# EAGLE design countdown_timer (EAGLE 7.6.0)
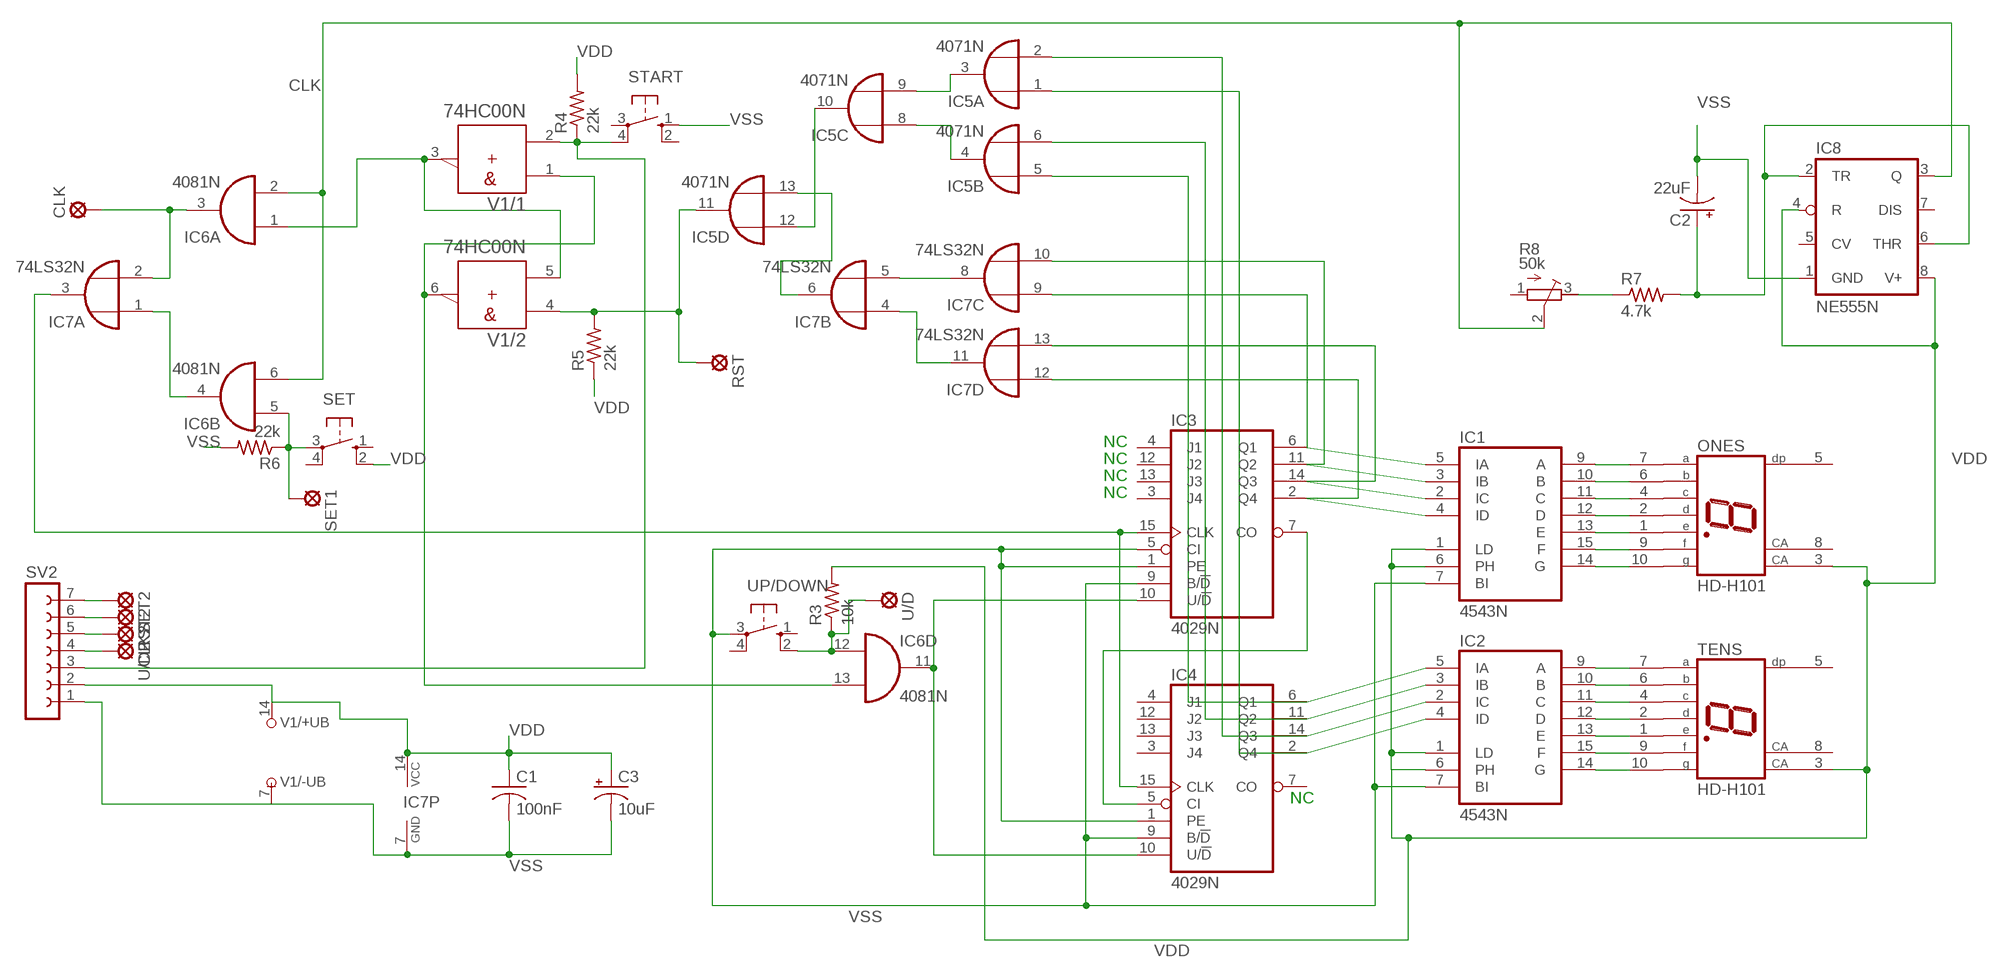
[diagram p0: schematic, sheet 1]

## Parts
C1  100nF  C-US025-024X044  [C025-024X044]
C2  22uF  CPOL-USE3.5-8  [E3,5-8]
C3  10uF  CPOL-USE3.5-8  [E3,5-8]
CLK  LSP10  [LSP10]
CLK2  LSP10  [LSP10]
IC1  4543N  [DIL16]
IC2  4543N  [DIL16]
IC3  4029N  [DIL16]
IC4  4029N  [DIL16]
IC5  4071N  [DIL14]
IC6  4081N  [DIL14]
IC7  74LS32N  [DIL14]
IC8  NE555N  [DIL08]
ONES  HD-H101  [HDSP-M]
R3  10k  R-US_0204/5  [0204/5]
R4  22k  R-US_0204/5  [0204/5]
R5  22k  R-US_0204/5  [0204/5]
R6  22k  R-US_0204/5  [0204/5]
R7  4.7k  R-US_0204/5  [0204/5]
R8  50k  R-TRIMM3339P  [RTRIM3339P]
RST  LSP10  [LSP10]
RST2  LSP10  [LSP10]
SET  10-XX  [B3F-10XX]
SET1  LSP10  [LSP10]
SET2  LSP10  [LSP10]
START  10-XX  [B3F-10XX]
SV2  FE07-1  [FE07]
TENS  HD-H101  [HDSP-M]
U/D  LSP10  [LSP10]
U/D2  LSP10  [LSP10]
UP/DOWN  10-XX  [B3F-10XX]
V1  74HC00N  [DIL14]

## Nets
CLK: IC6.2(A:I1) IC6.6(B:I1) IC8.3(Q) R8.2(S)
N$1: IC2.9(A) TENS.7(A)
N$2: IC2.10(B) TENS.6(B)
N$3: IC2.11(C) TENS.4(C)
N$4: IC2.12(D) TENS.2(D)
N$5: IC2.13(E) TENS.1(E)
N$6: IC2.15(F) TENS.9(F)
N$7: IC2.14(G) TENS.10(G)
N$8: IC1.9(A) ONES.7(A)
N$9: IC1.10(B) ONES.6(B)
N$10: IC1.11(C) ONES.4(C)
N$11: IC1.12(D) ONES.2(D)
N$12: IC1.13(E) ONES.1(E)
N$13: IC1.15(F) ONES.9(F)
N$14: IC1.14(G) ONES.10(G)
N$15: IC7.4(B:I0) IC7.11(D:O)
N$16: IC7.5(B:I1) IC7.8(C:O)
N$17: IC5.4(B:O) IC5.8(C:I0)
N$18: IC1.2(IC) IC3.14(Q3) IC7.13(D:I1)
N$19: IC2.5(IA) IC4.6(Q1) IC5.5(B:I0)
N$20: IC2.3(IB) IC4.11(Q2) IC5.6(B:I1)
N$21: IC2.2(IC) IC4.14(Q3) IC5.2(A:I1)
N$22: IC2.4(ID) IC4.2(Q4) IC5.1(A:I0)
N$23: IC3.7(CO) IC4.5(CI)
N$26: IC3.10(U/!D) IC4.10(U/!D) IC6.11(D:O)
N$27: IC6.12(D:I0) R3.1 U/D.MP UP/DOWN.2(S1)
N$28: IC5.11(D:O) R5.2 RST.MP V1.4(/2:A)
N$29: IC5.3(A:O) IC5.9(C:I1)
N$30: IC5.10(C:O) IC5.12(D:I0)
N$31: IC5.13(D:I1) IC7.6(B:O)
N$32: RST2.MP SV2.6
N$33: CLK2.MP SV2.5
N$34: SV2.4 U/D2.MP
N$35: IC6.1(A:I0) V1.3(/1:Y) V1.5(/2:B)
N$36: IC6.13(D:I1) V1.1(/1:A) V1.6(/2:Y)
N$37: R4.1 START.4(P1) SV2.3 V1.2(/1:B)
N$38: SET2.MP SV2.7
N$39: CLK.MP IC6.3(A:O) IC7.2(A:I1)
N$40: IC6.4(B:O) IC7.1(A:I0)
N$41: IC6.5(B:I0) R6.1 SET1.MP SET.3(P)
N$43: IC3.15(CLK) IC4.15(CLK) IC7.3(A:O)
N$44: R7.1 R8.3(E)
N$45: C2.+ IC8.2(TR) IC8.6(THR) R7.2
N$46: IC1.4(ID) IC3.2(Q4) IC7.12(D:I0)
N$47: IC1.3(IB) IC3.11(Q2) IC7.10(C:I1)
N$48: IC1.5(IA) IC3.6(Q1) IC7.9(C:I0)
VDD: C1.1 C3.+ IC1.1(LD) IC1.6(PH) IC2.1(LD) IC2.6(PH) IC7.14(P:VCC) IC8.4(R) IC8.8(V+) ONES.3(CA) R3.2 R4.2 R5.1 SET.2(S1) SV2.2 TENS.3(CA) V1.14(/+UB:+UB)
VSS: C1.2 C2.- C3.- IC1.7(BI) IC2.7(BI) IC3.1(PE) IC3.5(CI) IC3.9(B/!D) IC4.1(PE) IC4.9(B/!D) IC7.7(P:GND) IC8.1(GND) R6.2 START.1(S) SV2.1 UP/DOWN.3(P) V1.7(/-UB:-UB)
Unconnected: IC3.3(J4) IC3.4(J1) IC3.12(J2) IC3.13(J3) IC4.3(J4) IC4.4(J1) IC4.7(CO) IC4.12(J2) IC4.13(J3) IC6.8(C:I0) IC6.9(C:I1) IC6.10(C:O) IC8.5(CV) IC8.7(DIS) ONES.5(DP) ONES.8(CA) R8.1(A) SET.1(S) SET.4(P1) START.2(S1) START.3(P) TENS.5(DP) TENS.8(CA) UP/DOWN.1(S) UP/DOWN.4(P1) V1.8(/3:Y) V1.9(/3:A) V1.10(/3:B) V1.11(/4:Y) V1.12(/4:A) V1.13(/4:B)

## Notes on the sheet
- NC
- NC
- NC
- NC
- NC

## Power pins joined to a net without a drawn wire
VDD: IC1.16(VDD) IC2.16(VDD) IC3.16(VDD) IC4.16(VDD) IC5.14(P:VDD) IC6.14(P:VDD)
VSS: IC1.8(VSS) IC2.8(VSS) IC3.8(VSS) IC4.8(VSS) IC5.7(P:VSS) IC6.7(P:VSS)

## Library data of the parts
C1 = rcl:C-US: CAPACITOR, American symbol
C2 C3 = rcl:CPOL-US: POLARIZED CAPACITOR, American symbol
CLK CLK2 RST RST2 SET1 SET2 U/D U/D2 = solpad:LSP10: SOLDER PAD drill 1.0 mm, distributor Buerklin, 12H555
IC1 IC2 = 45xx:4543: BCD to 7-segment LCD DECODER
IC3 IC4 = 40xx:4029: Binary/decimal up/down COUNTER
IC5 = 40xx:4071: Quad 2-input OR
IC6 = 40xx:4081: Quad 2-input AND
IC7 = 74xx-eu:74*32: Quad 2-input OR gate
IC8 = linear:*555: TIMER
ONES TENS = display-hp:HD-H101: LED DISPLAY 1-character 7 segment, decimal point right; OC_FARNELL: unknown; OC_NEWARK: unknown
R3-R7 = rcl:R-US_: RESISTOR, American symbol
R8 = rcl:R-TRIMM: Trimm resistor
SET START UP/DOWN = switch-omron:10-XX: OMRON SWITCH; MPN: B3F-1000; OC_FARNELL: 176432; OC_NEWARK: 36M3542
SV2 = con-lsta:FE07-1: FEMALE HEADER; OC_FARNELL: unknown; OC_NEWARK: unknown
V1 = 74ttl-din:74*00: Quad 2-input NAND gate

## Board
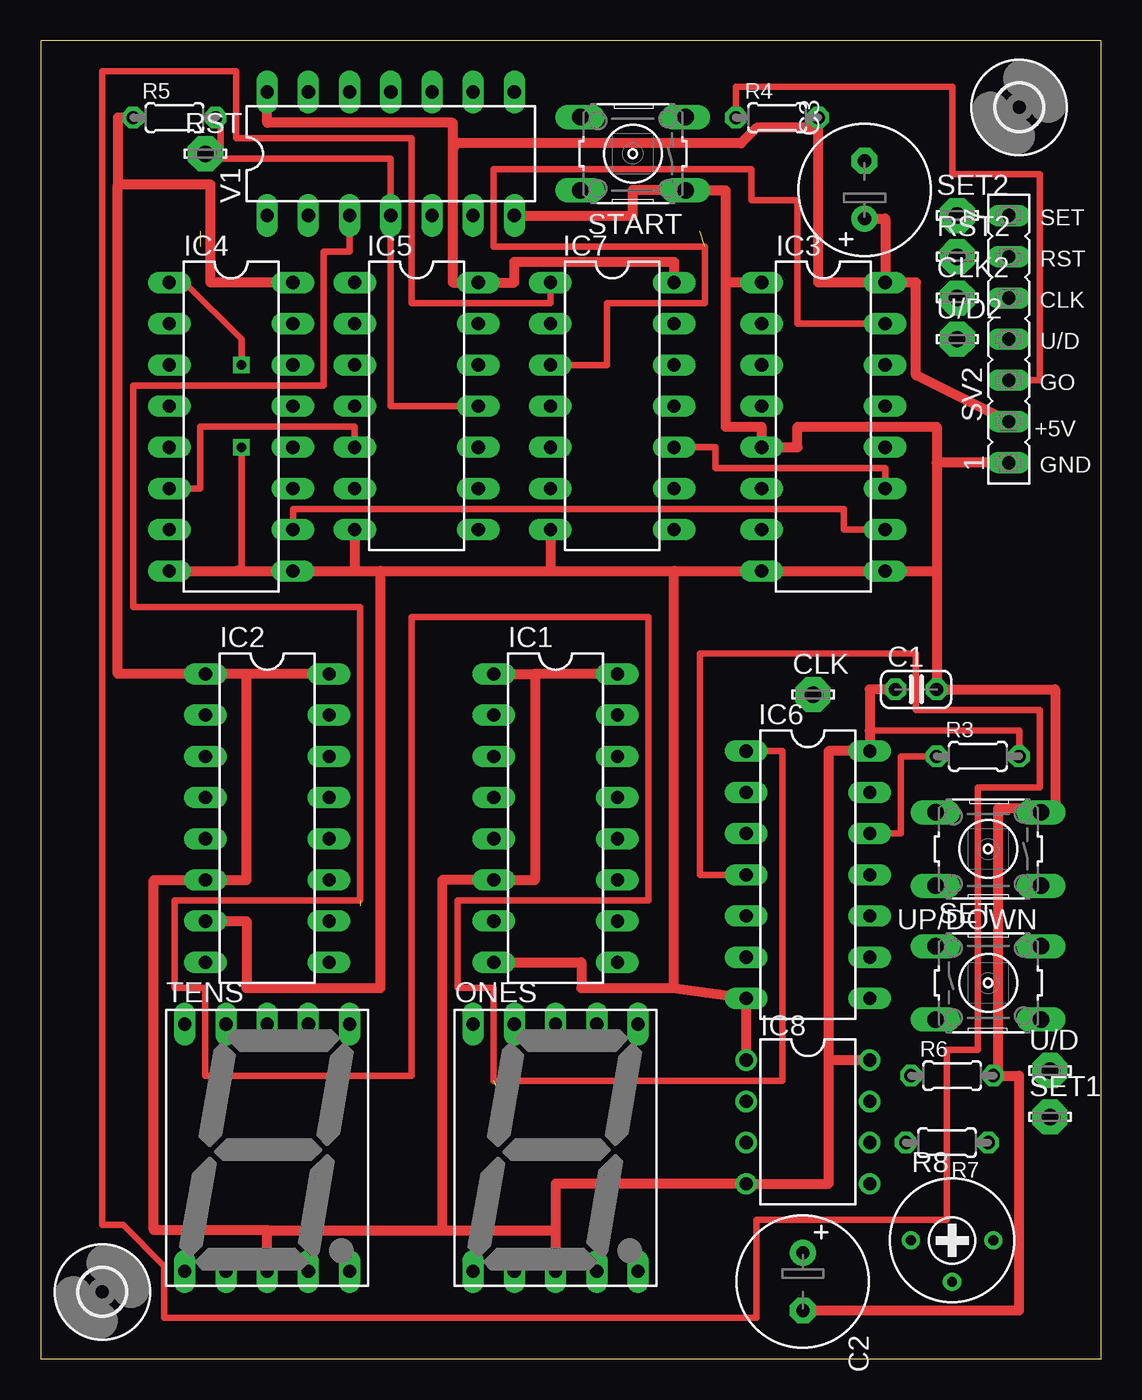
[diagram p1: board, top side]
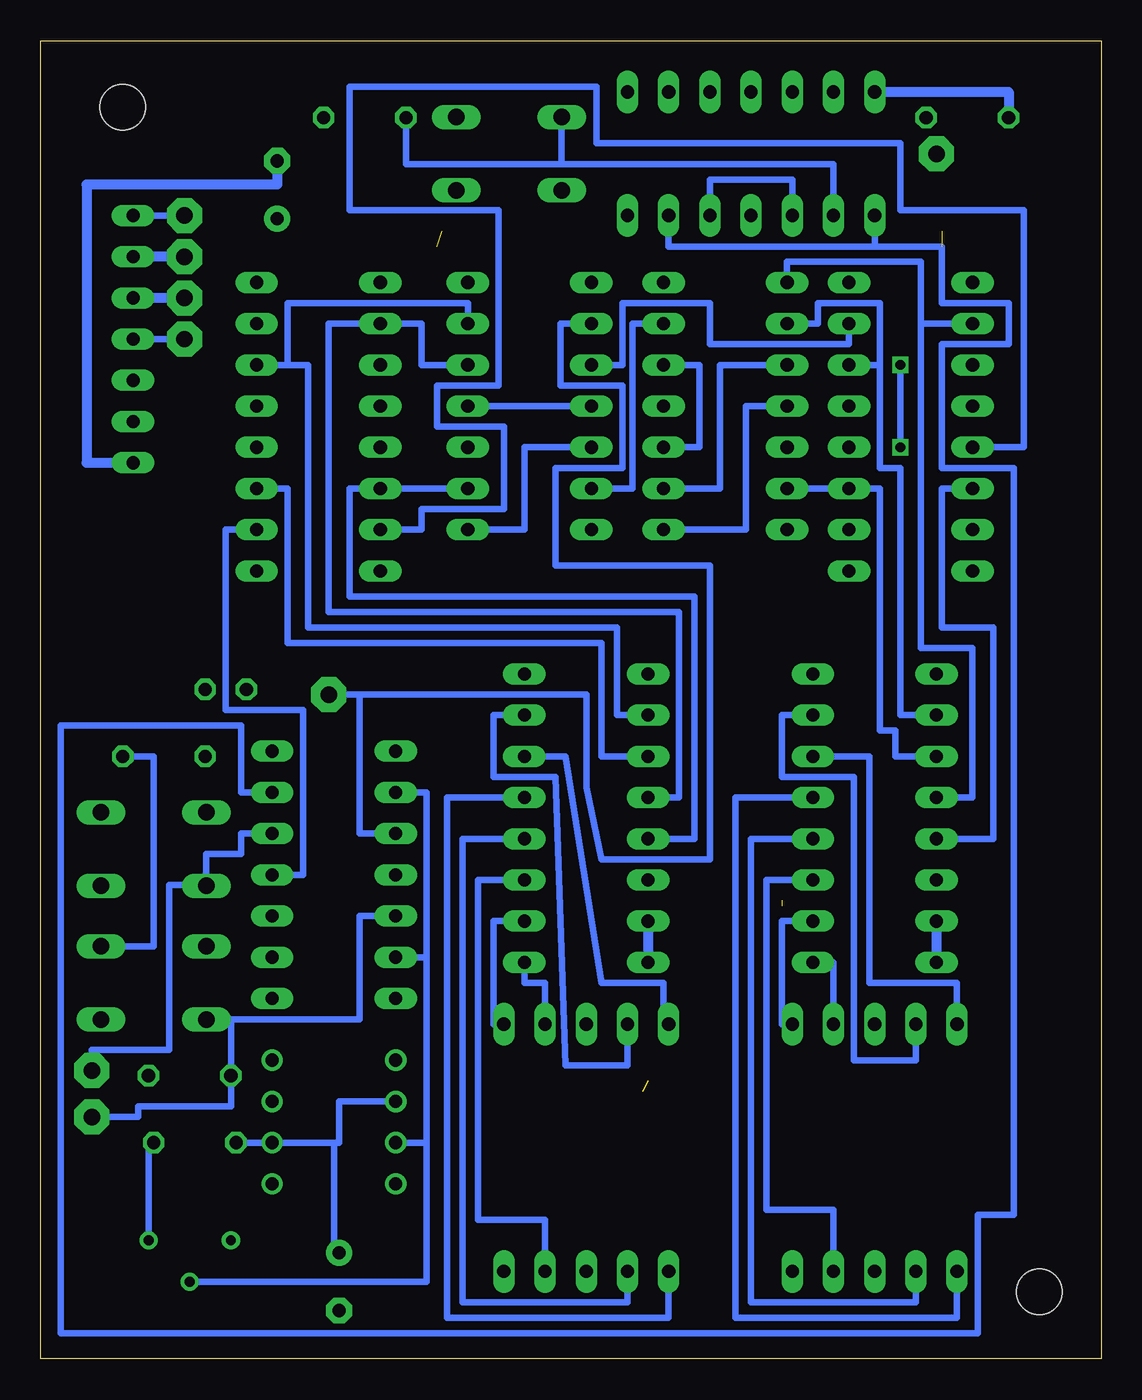
[diagram p2: board, bottom side, seen from below]

Size 65.39 x 81.27 mm. Coordinates in mm from the lower left corner, seen from the top.
Outline: 0,0 65.39,0 65.39,81.27 0,81.27 0,0
Copper layers (1*16): Top 0.035mm / dielectric 1.5mm / Bottom 0.035mm
Design rules "default": minimum track width 10mil, minimum drill 24mil, track to track 8mil, track to pad 8mil, pad to pad 8mil, via to via 8mil, smd to smd 8mil, copper to edge 40mil, drill to drill 8mil, minimum pad ring 10mil, minimum via ring 8mil, stop-mask expansion 4mil, vias tented up to drill 0mil, thermal gap 10mil

### Footprints (pad centres in the part's own frame; a part is rotated, then mirrored left to right if it is on the bottom)
C025-024X044 = drill 0.813 octagon: 1 -1.27,0; 2 1.27,0
E3,5-8 = drill 0.813 pad 1.6: + -1.778,0 | drill 0.813 pad 1.6 octagon: - 1.778,0
LSP10 = drill 1.016 pad 2.159 octagon: MP 0,0
DIL16 = drill 0.813 long: 1 -8.89,-3.81; 2 -6.35,-3.81; 3 -3.81,-3.81; 4 -1.27,-3.81; 5 1.27,-3.81; 6 3.81,-3.81; 7 6.35,-3.81; 8 8.89,-3.81; 9 8.89,3.81; 10 6.35,3.81; 11 3.81,3.81; 12 1.27,3.81; 13 -1.27,3.81; 14 -3.81,3.81; 15 -6.35,3.81; 16 -8.89,3.81
DIL14 = drill 0.813 long: 1 -7.62,-3.81; 2 -5.08,-3.81; 3 -2.54,-3.81; 4 0,-3.81; 5 2.54,-3.81; 6 5.08,-3.81; 7 7.62,-3.81; 8 7.62,3.81; 9 5.08,3.81; 10 2.54,3.81; 11 0,3.81; 12 -2.54,3.81; 13 -5.08,3.81; 14 -7.62,3.81
DIL08 = drill 0.813 pad 1.27: 1 -3.81,-3.81; 2 -1.27,-3.81; 3 1.27,-3.81; 4 3.81,-3.81; 5 3.81,3.81; 6 1.27,3.81; 7 -1.27,3.81; 8 -3.81,3.81
HDSP-M = drill 0.813 long: 1 -5.08,-7.62; 2 -2.54,-7.62; 3 0,-7.62; 4 2.54,-7.62; 5 5.08,-7.62; 6 5.08,7.62; 7 2.54,7.62; 8 0,7.62; 9 -2.54,7.62; 10 -5.08,7.62
0204/5 = drill 0.813 octagon: 1 -2.54,0; 2 2.54,0
RTRIM3339P = drill 0.61: 1 -2.54,0; 2 0,-2.54; 3 2.54,0
B3F-10XX = drill 1.016 long: 1 -3.251,2.261; 2 3.251,2.261; 3 -3.251,-2.261; 4 3.251,-2.261
FE07 = drill 0.813 long: 1 -7.62,0; 2 -5.08,0; 3 -2.54,0; 4 0,0; 5 2.54,0; 6 5.08,0; 7 7.62,0
2,8 = hole 2.8: 0,0

### Placement (x,y rotation side)
C1  53.98,41.27 0 top
C2  46.99,4.76 270 top
C3  50.8,72.07 90 top
CLK  47.62,40.96 0 top
CLK2  56.52,65.41 0 top
IC1  31.75,33.34 270 top
IC2  13.97,33.34 270 top
IC3  48.26,57.47 270 top
IC4  11.75,57.47 270 top
IC5  23.18,58.74 270 top
IC6  47.31,29.84 270 top
IC7  35.24,58.74 270 top
IC8  47.31,14.61 270 top
ONES  31.75,13.02 0 top
R3  57.78,37.15 0 top
R4  45.4,76.52 0 top
R5  8.26,76.52 0 top
R6  56.2,17.46 0 top
R7  55.88,13.34 180 top
R8  56.2,7.3 0 top
RST  10.16,74.3 0 top
RST2  56.52,67.94 0 top
SET  58.42,23.18 0 top
SET1  62.23,14.92 0 top
SET2  56.52,70.48 0 top
START  36.51,74.3 180 top
SV2  59.69,62.87 90 top
TENS  13.97,13.02 0 top
U$2  [2,8]  60.33,77.15 0 top
U$3  [2,8]  3.81,4.13 0 top
U/D  62.23,17.78 0 top
U/D2  56.52,62.87 0 top
UP/DOWN  58.42,31.43 180 top
V1  21.59,74.3 0 top

### Tracks (layer width: path | path; a pad name or v marks a point on that pad's centre or on a via)
CLK
  Bottom 0.406: IC8.3 41.59,13.34 | 41.59,13.34 41.59,24.77 | 41.59,24.77 IC6.6 | R8.2 41.59,4.76 41.59,13.34 | IC6.2 41.59,34.92 41.59,24.77
N$1
  Bottom 0.406: IC2.9 16.51,24.45 TENS.7
N$2
  Bottom 0.406: IC2.10 19.68,26.99 19.68,20.64 TENS.6
N$3
  Bottom 0.406: IC2.11 20.64,29.53 20.64,9.21 16.51,9.21 TENS.4
N$4
  Bottom 0.406: IC2.12 21.59,32.07 21.59,3.49 11.43,3.49 TENS.2
N$5
  Bottom 0.406: TENS.1 8.89,2.54 22.54,2.54 22.54,34.61 IC2.13
N$6
  Bottom 0.406: IC2.15 19.68,39.69 19.68,35.88 15.24,35.88 15.24,18.41 11.43,18.41 TENS.9
N$7
  Bottom 0.406: TENS.10 8.89,23.18 14.29,23.18 14.29,37.15 IC2.14
N$8
  Bottom 0.406: ONES.7 34.29,23.18 35.56,23.18 IC1.9
N$9
  Bottom 0.406: IC1.10 37.47,26.99 37.47,20.64 ONES.6
N$10
  Bottom 0.406: IC1.11 38.42,29.53 38.42,8.57 34.29,8.57 ONES.4
N$11
  Bottom 0.406: IC1.12 39.37,32.07 39.37,3.49 29.21,3.49 ONES.2
N$12
  Bottom 0.406: ONES.1 26.67,2.54 40.32,2.54 40.32,34.61 IC1.13
N$13
  Bottom 0.406: IC1.15 37.47,39.69 37.47,35.88 33.66,35.88 33.02,18.1 29.21,18.1 ONES.9
N$14
  Bottom 0.406: ONES.10 26.99,20.64 26.99,23.18 30.8,23.18 33.02,37.15 IC1.14
N$15
  Bottom 0.406: IC7.11 IC7.4
N$16
  Bottom 0.406: IC7.5 35.56,56.2 35.56,51.12 IC7.8
N$17
  Bottom 0.406: IC5.4 21.91,58.74 21.91,51.12 IC5.8
N$18
  Bottom 0.406: IC3.14 50.16,61.28 | 50.16,61.28 50.16,65.09 39.05,65.09 IC7.13 | IC1.2 29.84,39.69 29.84,45.09 48.9,45.09 48.9,61.28 50.16,61.28
N$19
  Top 0.406: IC4.6 9.84,53.66 9.84,57.47 19.37,57.47 IC5.5
  Bottom 0.406: IC4.6 9.84,53.66 9.84,45.09 6.67,45.09 6.67,32.07 IC2.5
N$20
  Bottom 0.406: IC2.3 12.7,37.15 12.7,38.73 13.65,38.73 13.65,53.66 IC4.11 IC5.6
N$21
  Bottom 0.406: IC4.14 13.65,61.28 | IC2.2 12.38,39.69 12.38,54.93 13.65,54.93 13.65,61.28 | IC5.2 17.46,63.82 17.46,65.09 13.65,65.09 13.65,61.28
N$22
  Bottom 0.406: IC2.4 7.94,34.61 7.94,43.81 11.11,43.81 11.11,63.82 | 11.11,63.82 IC4.2 | 11.11,63.82 11.11,67.63 19.37,67.63 IC5.1
N$23
  Bottom 0.406: IC4.5 4.76,56.2 4.76,70.8 12.38,70.8 12.38,74.93 31.11,74.93 31.11,78.42 46.35,78.42 46.35,70.8 37.15,70.8 37.15,60.01 40.96,60.01 40.96,57.47 36.83,57.47 36.83,52.39 41.91,52.39 41.91,51.12 IC3.7
N$26
  Top 0.406: IC4.10 15.56,52.39 49.53,52.39 49.53,51.12 IC3.10
  Bottom 0.406: IC6.11 49.21,29.84 49.21,40.01 53.98,40.01 53.98,51.12 IC3.10
N$27
  Top 0.406: R3.1 53.02,37.15 53.02,32.38 IC6.12
  Bottom 0.406: IC6.12 53.02,32.38 53.02,31.11 55.17,31.11 UP/DOWN.2 55.17,29.21 57.47,29.21 57.47,19.05 62.23,19.05 U/D.MP
N$28
  Top 0.406: IC5.11 21.59,58.74 V1.4 21.59,73.98 11.11,73.98 11.11,74.3 | R5.2 11.11,76.52 11.11,74.3 | RST.MP 11.11,74.3
N$29
  Bottom 0.406: IC5.3 23.5,61.28 23.5,53.66 IC5.9
N$30
  Bottom 0.406: IC5.10 24.77,56.2 24.77,61.28 IC5.12
N$31
  Bottom 0.406: IC5.13 28.89,63.82 28.89,53.66 IC7.6
N$32
  Bottom 0.61: RST2.MP SV2.6
N$33
  Bottom 0.61: CLK2.MP SV2.5
N$34
  Bottom 0.406: U/D2.MP SV2.4
N$35  (3 unrouted)
  Top 0.406: V1.3 19.05,68.26 17.46,68.26 17.46,60.01 5.71,60.01 5.71,46.35 19.68,46.35 19.68,28.26 8.26,28.26 8.26,22.86 10.16,22.86 10.16,17.46 22.86,17.46 22.86,45.72 37.47,45.72 37.47,28.26 25.72,28.26 25.72,22.86 27.94,22.86 27.94,17.14 45.72,17.14 45.72,37.47 IC6.1
  Bottom 0.406: V1.3 19.05,72.71 24.13,72.71 V1.5
N$36  (1 unrouted)
  Bottom 0.406: V1.6 26.67,68.58 13.97,68.58 | 13.97,68.58 V1.1 | IC6.13 53.02,34.92 53.02,39.05 64.14,39.05 64.14,1.59 7.62,1.59 7.62,8.89 5.4,8.89 5.4,54.93 9.84,54.93 9.84,62.55 5.71,62.55 5.71,65.09 9.84,65.09 9.84,68.58 13.97,68.58
N$37
  Top 0.406: R4.1 42.86,78.42 56.2,78.42 56.2,73.03 61.59,73.03 61.59,60.33 SV2.3
  Bottom 0.406: V1.2 16.51,73.66 33.26,73.66 | 33.26,73.66 START.4 | 33.26,73.66 42.86,73.66 R4.1
N$38
  Bottom 0.406: SET2.MP SV2.7
N$39
  Bottom 0.406: IC7.2 33.34,63.82 33.34,60.01 29.53,60.01 29.53,54.93 33.66,54.93 33.66,48.9 24.13,48.9 24.13,30.8 30.8,30.8 31.75,35.24 31.75,40.96 45.72,40.96 | 45.72,40.96 45.72,32.38 IC6.3 | CLK.MP 45.72,40.96
N$40
  Top 0.406: IC7.1 31.43,65.09 22.86,65.09 22.86,75.25 12.06,75.25 12.06,79.38 3.81,79.38 3.81,8.26 5.08,8.26 7.62,5.71 7.62,2.54 44.13,2.54 44.13,8.57 55.88,8.57 55.88,19.05 57.78,19.05 57.78,35.24 61.59,35.24 61.59,40.01 53.98,40.01 53.98,43.5 40.64,43.5 40.64,29.84 IC6.4
N$41
  Bottom 0.406: SET.3 53.66,20.92 | 53.66,20.92 45.72,20.92 45.72,27.3 IC6.5 | 53.66,20.92 R6.1 53.66,15.56 59.37,15.56 59.37,14.92 SET1.MP
N$43  (1 unrouted)
  Top 0.406: IC7.3 34.92,61.28 34.92,65.09 40.96,65.09 40.96,68.58 27.94,68.58 27.94,73.34 43.81,73.34 43.81,71.44 46.67,71.44 46.67,63.82 IC3.15
  Bottom 0.406: IC4.15 15.56,62.55 24.13,62.55 24.13,65.09 29.53,65.09 29.53,61.28 IC7.3
N$44
  Bottom 0.406: R7.1 58.74,13.34 R8.3
N$45
  Bottom 0.406: 47.31,13.34 IC8.6 R7.2 | 47.31,13.34 46.99,13.34 46.99,15.88 IC8.2 | C2.+ 47.31,6.54 47.31,13.34
N$46
  Bottom 0.406: IC1.4 26.04,34.61 26.04,46.04 47.62,46.04 47.62,63.82 IC3.2 41.91,63.82 41.91,61.28 IC7.12
N$47
  Top 0.406: IC7.10 41.59,56.2 41.59,54.93 52.07,54.93 IC3.11
  Bottom 0.406: IC1.3 30.8,37.15 30.8,44.13 50.16,44.13 50.16,53.66 IC3.11
N$48
  Bottom 0.406: IC1.5 25.08,32.07 25.08,46.99 46.35,46.99 46.35,53.66 IC3.6 IC7.9
VDD
  Top 0.406: R3.2 60.33,38.73 51.12,38.73
  Top 0.61: TENS.3 13.97,7.94 | 13.97,7.94 24.77,7.94 | 24.77,7.94 31.75,7.94 | 31.75,7.94 ONES.3 | IC1.16 30.48,42.23 | IC2.16 12.7,42.23 | 12.7,42.23 IC2.1 4.76,42.23 4.76,72.39 | 12.7,42.23 12.7,29.53 IC2.6 6.99,29.53 6.99,7.94 13.97,7.94 | IC1.1 30.48,42.23 | 30.48,42.23 30.48,29.53 IC1.6 24.77,29.53 24.77,7.94 | IC8.8 48.58,18.41 | 48.58,18.41 48.58,10.79 IC8.4 31.75,10.79 31.75,7.94 | IC3.16 47.94,66.36 47.94,75.88 | 47.94,75.88 R4.2 | IC4.16 10.48,66.36 10.48,72.39 4.76,72.39 | 48.58,18.41 48.58,37.47 IC6.14 51.12,38.73 51.12,41.27 C1.1 | IC7.14 39.05,67.63 29.21,67.63 29.21,66.36 IC5.14 25.4,66.36 25.4,74.61 | V1.14 13.97,76.2 25.4,76.2 25.4,74.61 | IC3.16 53.98,66.36 53.98,60.64 SV2.2 | C3.+ 52.07,70.29 IC3.16 | R5.1 4.76,76.52 4.76,72.39 | 47.94,75.88 44.13,75.88 43.18,74.93 25.72,74.93 25.4,74.61
  Bottom 0.406: SET.2 58.42,25.44 58.42,37.15 R3.2
  Bottom 0.61: V1.14 5.71,78.11 R5.1
VSS  (via drill 0.6)
  Top 0.406: IC4.1 8.89,66.36 12.38,62.87 v12.38,61.28 | v12.38,56.2 12.38,48.9 12.06,48.58
  Top 0.61: IC4.8 12.06,48.58 IC4.9 19.37,48.58 | 55.24,48.58 IC3.9 IC3.8 39.05,48.58 | 55.24,48.58 C1.2 62.55,41.27 62.55,33.97 61.67,33.97 | C2.- 60.33,2.98 60.33,17.46 59.05,17.46 | 59.05,17.46 59.05,33.97 61.67,33.97 | 61.67,33.97 UP/DOWN.3 | V1.7 36.51,70.48 36.51,72.07 39.76,72.07 START.1 42.23,72.03 42.23,66.36 | 42.23,66.36 42.23,57.47 44.45,57.47 IC3.5 46.67,56.2 46.67,57.47 55.24,57.47 55.24,55.24 | 55.24,55.24 55.24,48.58 | 19.37,48.58 20.95,48.58 | 20.95,48.58 31.43,48.58 | 31.43,48.58 39.05,48.58 | IC5.7 19.37,48.58 | IC2.7 12.7,26.99 12.7,22.86 20.95,22.86 20.95,48.58 | IC7.7 31.43,48.58 | IC1.8 33.34,24.45 33.34,22.86 38.73,22.86 | 39.05,48.58 39.05,22.86 38.73,22.86 | IC8.1 IC6.7 38.73,22.86 | R6.2 59.05,17.46 | SV2.1 55.24,55.24 | IC3.1 42.23,66.36
  Bottom 0.406: v12.38,61.28 v12.38,56.2
  Bottom 0.61: IC2.7 IC2.8 | IC1.7 IC1.8 | C3.- 50.8,72.39 62.55,72.39 62.55,55.24 SV2.1

### Text on the board
tNames: SET | RST | CLK | U/D | GO | +5V | GND